# Altium schematic sheet V1.0.SchDoc
size 152 x 55 mm
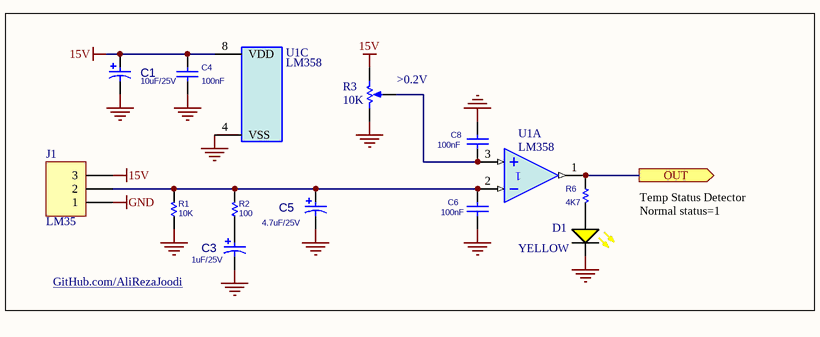
[diagram p0: V1.0.SchDoc]

## Parts
C1  10uF/25V  [C_THD_EL_(P2.54-D6-H11)]
C3  1uF/25V  [C_THD_EL_(P2.54-D6-H11)]
C4  100nF  [C_THD_CER_(P2.54-D3.5-T1.5)]
C5  4.7uF/25V  [C_THD_EL_(P2.54-D6-H11)]
C6  100nF  [C_THD_CER_(P2.54-D3.5-T1.5)]
C8  100nF  [C_THD_CER_(P2.54-D3.5-T1.5)]
D1  YELLOW  [LED_THD_5MM_YELLOW]
J1  3PIN  [Connector_Phoenix_3PIN_MSTB]  (value not drawn)
R1  10K  [R_THD_AXIAL0.4(1/4W)]
R2  100  [R_THD_AXIAL0.4(1/4W)]
R3  10K  [POT_THD_3296W]
R6  4K7  [R_THD_AXIAL0.4(1/4W)]
U1  LM358  [751-02_L]  (parts A,C of 3)

## Ports
OUT (out)

## Nets
15V: C1.1 C4.1 J1.3 R3.1(TOP) U1.8(VDD)
GND: C1.2 C3.2 C4.2 C5.2 C6.2 C8.2 D1.2(K) J1.1 R1.2 R3.3(BOT) U1.4(VSS)
OUT: R6.2 U1.1(OUT) ; port OUT
NetC3_1: C3.1 R2.2
NetC5_1: C5.1 C6.1 J1.2 R1.1 R2.1 U1.2(IN-)
NetC8_1: C8.1 R3.2(TAP) U1.3(IN+)
NetD1_1: D1.1(A) R6.1

## Notes on the sheet
- (near R3) >0.2V
- (near J1) LM35
- Temp Status Detector
  Normal status=1
- GitHub.com/AliRezaJoodi

## Library data of the parts
C1 C3 C5 = Capacitor_Electrolytic: Capacitor, Electrolytic
C4 C6 C8 = Capacitor_Ceramic: Capacitor, Ceramic Multilayer
D1 = LED_YELLOW: LED, Yellow; Manufacturer: Generic Components; Class I: Optoelectronic; Published: 8-Jun-2000; Revision: July-2002: Re-released for DXP Platform.; Publisher: Altium Limited; Class II: LED
J1 = Header 3: Header, 3-Pin; Manufacturer: Generic Components; Class I: Connector; Revision: July-2002: Re-released for DXP Platform.; Publisher: Altium Limited
R1 R2 R6 = Resistor: Resistor,
R3 = Resistor_Pot: Potentiometer; Revision: July-2002: Re-released for DXP Platform.
U1 = LM358: Dual Low-Power Operational Amplifier; Published: 17-Jul-2002; LatestRevisionDate: 13-Apr-2006; LatestRevisionNote: IPC-7351 Footprint Added.; DatasheetVersion: 1988; PackageReference: 751-02; Publisher: Altium Limited; PackageDescription: 8-Pin Small Outline Integrated Circuit 1.27 mm Pitch; Code_JEDEC: MS-012-AA; Code_IPC: SOIC127P600-8; ComponentLink1Description: Manufacturer Link; ComponentLink1URL: http://www.onsemi.com/site/products/parametrics/0,4446,251,00.html; ComponentLink2Description: Datasheet; ComponentLink2URL: http://www.onsemi.com/pub/Collateral/LM358-D.PDF